# EAGLE design gpi-pwr (EAGLE 7.5.0)
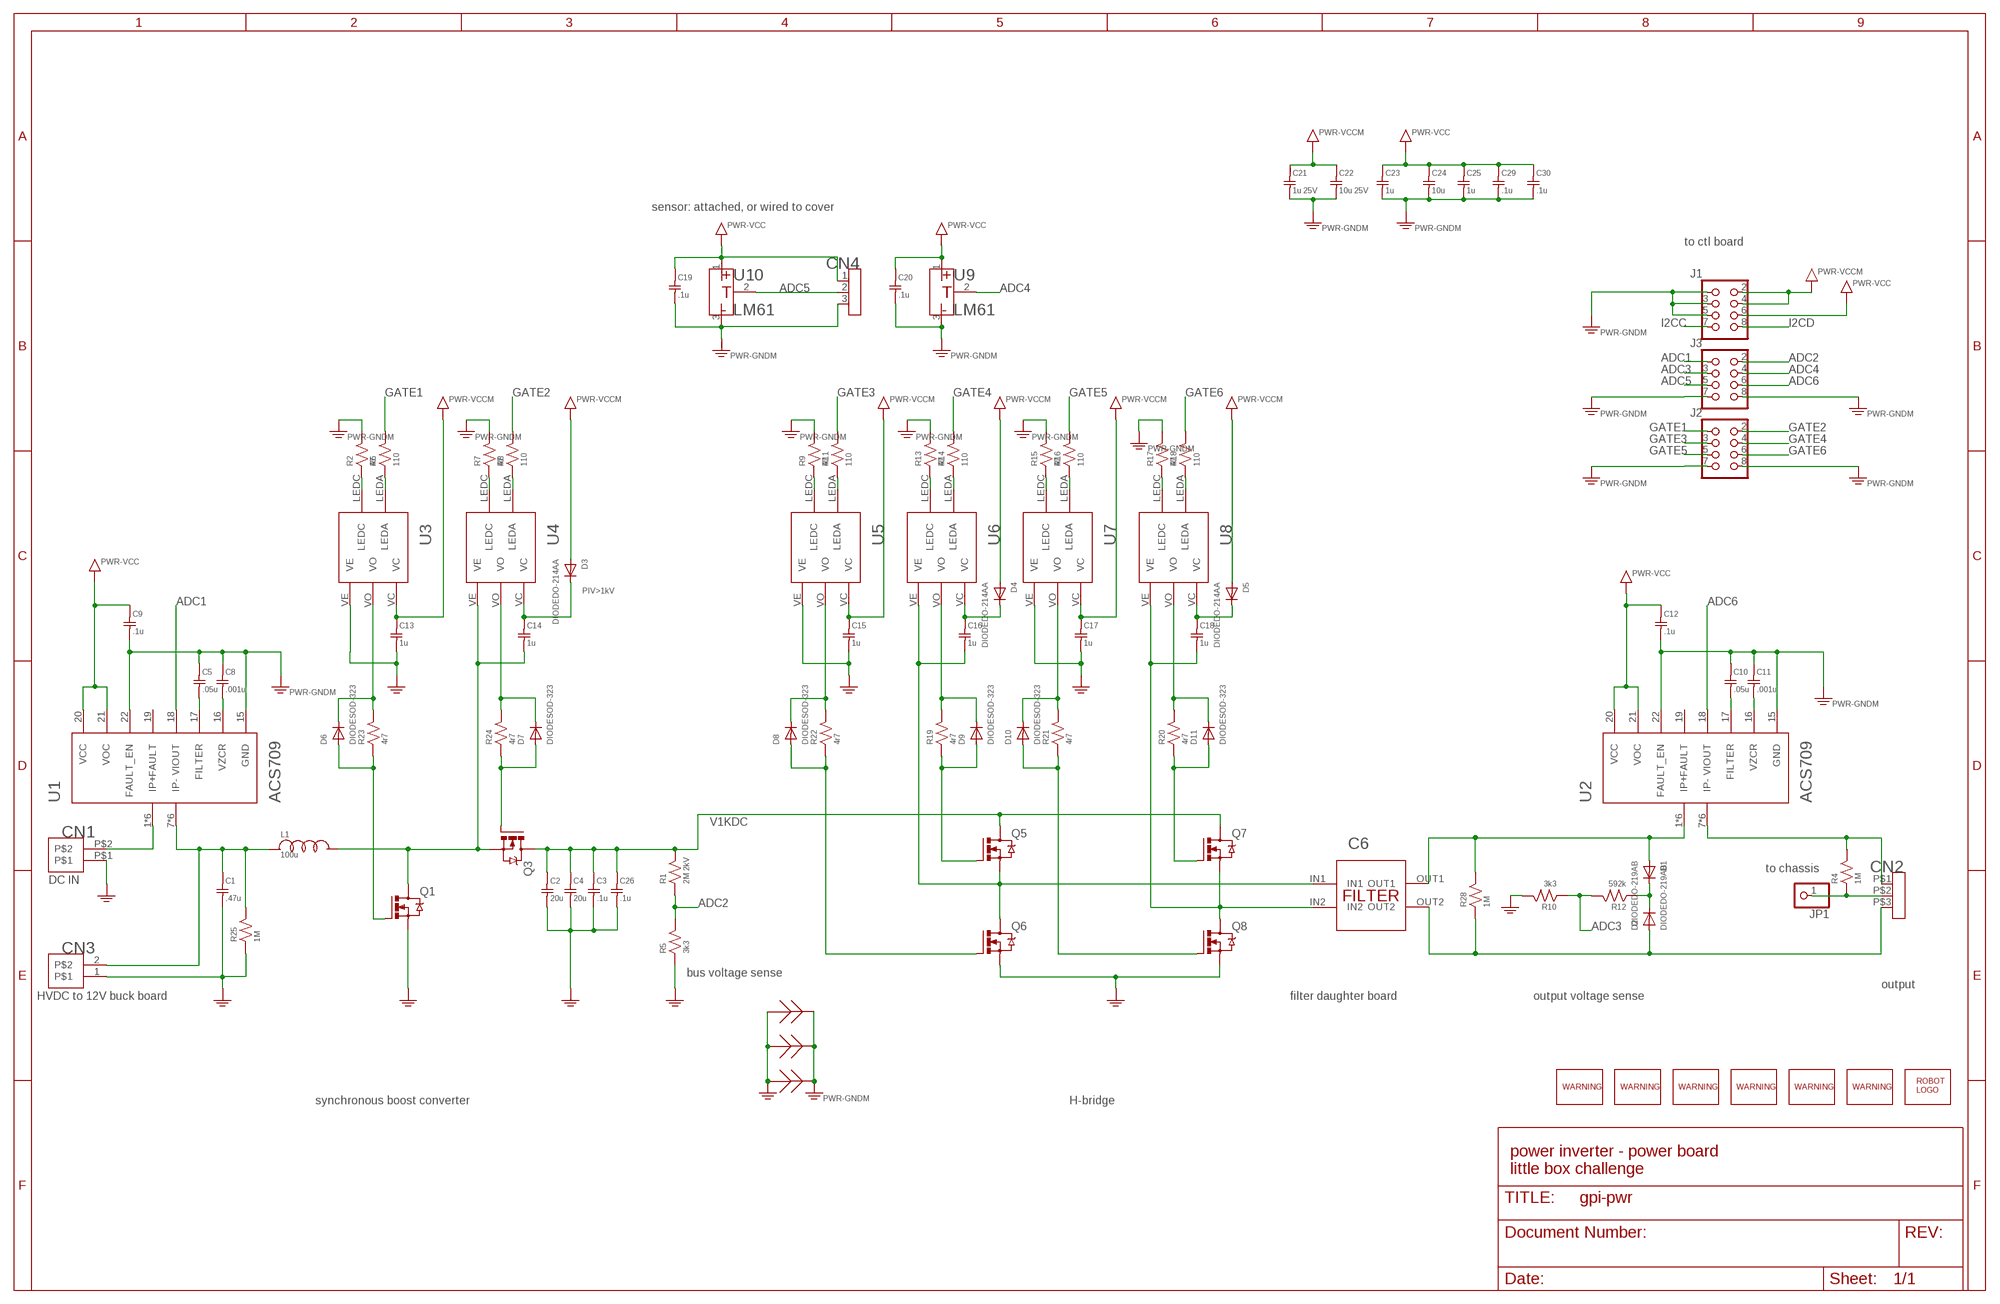
[diagram p0: schematic, sheet 1]

## Parts
C1  .47u  CR46KI333000N1M  [R46KI333000N1M]
C2  20u  CMKP1848S62010JY5F  [MKP1848S62010JY5F]
C3  .1u  C2220  [SMD2220]
C4  20u  CMKP1848S62010JY5F  [MKP1848S62010JY5F]
C5  .05u  C0603  [SMD0603]
C6  FILTER  [FILTER-B4R0]
C8  .001u  C0603  [SMD0603]
C9  .1u  C0603  [SMD0603]
C10  .05u  C0603  [SMD0603]
C11  .001u  C0603  [SMD0603]
C12  .1u  C0603  [SMD0603]
C13  1u  C0603  [SMD0603]
C14  1u  C0603  [SMD0603]
C15  1u  C0603  [SMD0603]
C16  1u  C0603  [SMD0603]
C17  1u  C0603  [SMD0603]
C18  1u  C0603  [SMD0603]
C19  .1u  C0603  [SMD0603]
C20  .1u  C0603  [SMD0603]
C21  1u 25V  C0603  [SMD0603]
C22  10u 25V  C0603  [SMD0603]
C23  1u  C0603  [SMD0603]
C24  10u  C0603  [SMD0603]
C25  1u  C0603  [SMD0603]
C26  .1u  C2220  [SMD2220]
C29  .1u  C0603  [SMD0603]
C30  .1u  C0603  [SMD0603]
CN1  HEADER-1X2  [CONN-10AWG-2]
CN2  HEADER-3X1  [CONN-10AWG-3]
CN3  HEADER-1X2.4  [HEADER-1X2-THM-WIDE]
CN4  HEADER-3X12MM  [HEADER-3X1-2SMD]
D1  DIODEDO-219AB  [DO-219AB]
D2  DIODEDO-219AB  [DO-219AB]
D3  DIODEDO-214AA  [DO-214AA]
D4  DIODEDO-214AA  [DO-214AA]
D5  DIODEDO-214AA  [DO-214AA]
D6  DIODESOD-323  [SOD-323]
D7  DIODESOD-323  [SOD-323]
D8  DIODESOD-323  [SOD-323]
D9  DIODESOD-323  [SOD-323]
D10  DIODESOD-323  [SOD-323]
D11  DIODESOD-323  [SOD-323]
J1  HEADER-2X4  [HEADER-2X04]
J2  HEADER-2X4  [HEADER-2X04]
J3  HEADER-2X4  [HEADER-2X04]
JP1  PINHD-1X1  [1X01]
L1  100u  LAIRD03  [AIRD03]
Q1  C2M0160120D  MOSFETTO247REV  [TO-247-3-DOWN]
Q3  C2M0160120D  MOSFETTO247REV  [TO-247-3-DOWN]
Q5  C2M0160120D  MOSFETTO247REV  [TO-247-3-DOWN]
Q6  C2M0160120D  MOSFETTO247REV  [TO-247-3-DOWN]
Q7  C2M0160120D  MOSFETTO247REV  [TO-247-3-DOWN]
Q8  C2M0160120D  MOSFETTO247REV  [TO-247-3-DOWN]
R1  2M 2kV  R2512  [SMD2512]
R2  47  R0603  [SMD0603]
R4  1M  R1206  [SMD1206]
R5  3k3  R0603  [SMD0603]
R6  110  R0603  [SMD0603]
R7  47  R0603  [SMD0603]
R8  110  R0603  [SMD0603]
R9  47  R0603  [SMD0603]
R10  3k3  R0603  [SMD0603]
R11  110  R0603  [SMD0603]
R12  592k  R1206  [SMD1206]
R13  47  R0603  [SMD0603]
R14  110  R0603  [SMD0603]
R15  47  R0603  [SMD0603]
R16  110  R0603  [SMD0603]
R17  47  R0603  [SMD0603]
R18  110  R0603  [SMD0603]
R19  4r7  RSMD0508  [SMD0508]
R20  4r7  RSMD0508  [SMD0508]
R21  4r7  RSMD0508  [SMD0508]
R22  4r7  RSMD0508  [SMD0508]
R23  4r7  RSMD0508  [SMD0508]
R24  4r7  RSMD0508  [SMD0508]
R25  1M  R1206  [SMD1206]
R28  1M  R1206  [SMD1206]
U1  ACS709  [QSOP24]
U2  ACS709  [QSOP24]
U3  ACPL-P346P346  [ACPL-P346]
U4  ACPL-P346P346  [ACPL-P346]
U5  ACPL-P346P346  [ACPL-P346]
U6  ACPL-P346P346  [ACPL-P346]
U7  ACPL-P346P346  [ACPL-P346]
U8  ACPL-P346P346  [ACPL-P346]
U9  LM61  TEMPERATURE  [SOT-23]
U10  LM61  TEMPERATURE  [SOT-23]
U$1  ROBOTMAN-LOGO  [ROBOTMAN-LOGO]
U$2  SYMBOL-WARNING  [SYMBOL-WARNING]
U$3  SYMBOL-WARNING  [SYMBOL-WARNING]
U$4  SYMBOL-WARNING  [SYMBOL-WARNING]
U$5  SYMBOL-WARNING  [SYMBOL-WARNING]
U$6  SYMBOL-WARNING  [SYMBOL-WARNING]
U$7  SYMBOL-WARNING  [SYMBOL-WARNING]
Z1  SHORT  [SHORT]
Z2  SHORT  [SHORT]
Z3  SHORT  [SHORT]

## Nets
ADC1: J3.1 U1.18(VIOUT)
ADC2: J3.2 R1.P$1 R5.2
ADC3: J3.3 R10.1 R12.2
ADC4: J3.4 U9.2(OUT)
ADC5: CN4.2 J3.5 U10.2(OUT)
ADC6: J3.6 U2.18(VIOUT)
GATE1: J2.1 R6.2
GATE2: J2.2 R8.2
GATE3: J2.3 R11.2
GATE4: J2.4 R14.2
GATE5: J2.5 R16.2
GATE6: J2.6 R18.2
GND: C1.P$2 C2.2A C2.2B C3.P$2 C4.2A C4.2B C13.2 C15.2 C17.2 C26.P$2 CN1.P$1 CN3.1 Q1.3(S) Q6.3(S) Q8.3(S) R5.1 R10.2 R25.1 U3.VE U5.VE U7.VE Z1.P$1 Z2.P$1 Z3.P$1 ; supply symbol labelled PWR-GND
GNDM: C5.1 C8.1 C9.2 C10.1 C11.1 C12.2 C19.2 C20.2 C21.2 C22.2 C23.2 C24.2 C25.2 C29.2 C30.2 CN4.3 J1.1 J1.3 J1.5 J2.7 J2.8 J3.7 J3.8 R2.2 R7.2 R9.2 R13.2 R15.2 R17.2 U1.15(GND) U1.22(FAULT_EN) U2.15(GND) U2.22(FAULT_EN) U9.3(G) U10.3(G) Z1.P$2 Z2.P$2 Z3.P$2 ; supply symbol labelled PWR-GNDM
I2CC: J1.7
I2CD: J1.8
N$1: CN1.P$2 U1.1(IP+) U1.2(IP+) U1.3(IP+) U1.4(IP+) U1.5(IP+) U1.6(IP+)
N$2: D9.C R19.P$2 U6.VO
N$4: C14.2 L1.P$2 Q1.2(D) Q3.3(S) U4.VE
N$5: D6.A Q1.1(G) R23.P$1
N$6: D6.C R23.P$2 U3.VO
N$7: C1.P$1 CN3.2 L1.P$1 R25.2 U1.7(IP-) U1.8(IP-) U1.9(IP-) U1.10(IP-) U1.11(IP-) U1.12(IP-)
N$9: D1.C D2.C R12.1
N$10: CN2.P$1 R4.2 U2.7(IP-) U2.8(IP-) U2.9(IP-) U2.10(IP-) U2.11(IP-) U2.12(IP-)
N$11: CN2.P$2 JP1.1 R4.1
N$12: C5.2 U1.17(FILTER)
N$13: C8.2 U1.16(VZCR)
N$14: C10.2 U2.17(FILTER)
N$15: C6.IN1 C16.2 Q5.3(S) Q6.2(D) U6.VE
N$16: C6.IN2 C18.2 Q7.3(S) Q8.2(D) U8.VE
N$17: C11.2 U2.16(VZCR)
N$18: C14.1 D3.C U4.VC
N$19: D9.A Q5.1(G) R19.P$1
N$20: D8.A Q6.1(G) R22.P$1
N$21: D10.A Q8.1(G) R21.P$1
N$22: D11.A Q7.1(G) R20.P$1
N$23: R2.1 U3.LEDC
N$24: C6.OUT1 D1.A R28.2 U2.1(IP+) U2.2(IP+) U2.3(IP+) U2.4(IP+) U2.5(IP+) U2.6(IP+)
N$25: C6.OUT2 CN2.P$3 D2.A R28.1
N$28: C16.1 D4.C U6.VC
N$29: R6.1 U3.LEDA
N$30: C18.1 D5.C U8.VC
N$31: R7.1 U4.LEDC
N$34: R8.1 U4.LEDA
N$35: R9.1 U5.LEDC
N$36: R11.1 U5.LEDA
N$37: R13.1 U6.LEDC
N$38: R14.1 U6.LEDA
N$39: R15.1 U7.LEDC
N$40: R16.1 U7.LEDA
N$41: R17.1 U8.LEDC
N$42: R18.1 U8.LEDA
N$43: D11.C R20.P$2 U8.VO
N$44: D8.C R22.P$2 U5.VO
N$46: D10.C R21.P$2 U7.VO
N$47: D7.C R24.P$2 U4.VO
N$48: D7.A Q3.1(G) R24.P$1
V1KDC: C2.1A C2.1B C3.P$1 C4.1A C4.1B C26.P$1 Q3.2(D) Q5.2(D) Q7.2(D) R1.P$2
VCC: C9.1 C12.1 C19.1 C20.1 C23.1 C24.1 C25.1 C29.1 C30.1 CN4.1 J1.6 U1.20(VCC) U1.21(VOC) U2.20(VCC) U2.21(VOC) U9.1(V) U10.1(V) ; supply symbol labelled PWR-VCC
VCCM: C13.1 C15.1 C17.1 C21.1 C22.1 D3.A D4.A D5.A J1.2 J1.4 U3.VC U5.VC U7.VC ; supply symbol labelled PWR-VCCM
Unconnected: U1.19(FAULT) U2.19(FAULT)

## Notes on the sheet
- sensor: attached, or wired to cover
- to ctl board
- PIV>1kV
- to chassis
- DC IN
- bus voltage sense
- output
- HVDC to 12V buck board | filter daughter board | output voltage sense
- synchronous boost converter | H-bridge
- power inverter - power board
  little box challenge

## Library data of the parts
C1-C5 C8-C26 C29 C30 = jaw:C
C6 = jaw-brd:FILTER
CN1 CN3 = jaw:HEADER-1X2
CN2 CN4 = jaw:HEADER-3X1
D1-D11 = jaw:DIODE
J1-J3 = jaw:HEADER-2X4: PIN HEADER
JP1 = adafruit:PINHD-1X1: Pin header 1x1 for 0.1" spacing With round pins
L1 = jaw:L
Q1 Q3 Q5-Q8 = jaw:MOSFET
R1 R2 R4-R25 R28 = jaw:R
U1 U2 = jaw:ACS709
U3-U8 = jaw:ACPL-P346
U9 U10 = jaw:TEMPERATURE
U$1 = jaw:ROBOTMAN-LOGO
U$2-U$7 = jaw:SYMBOL-WARNING
Z1-Z3 = jaw:SHORT

## Board
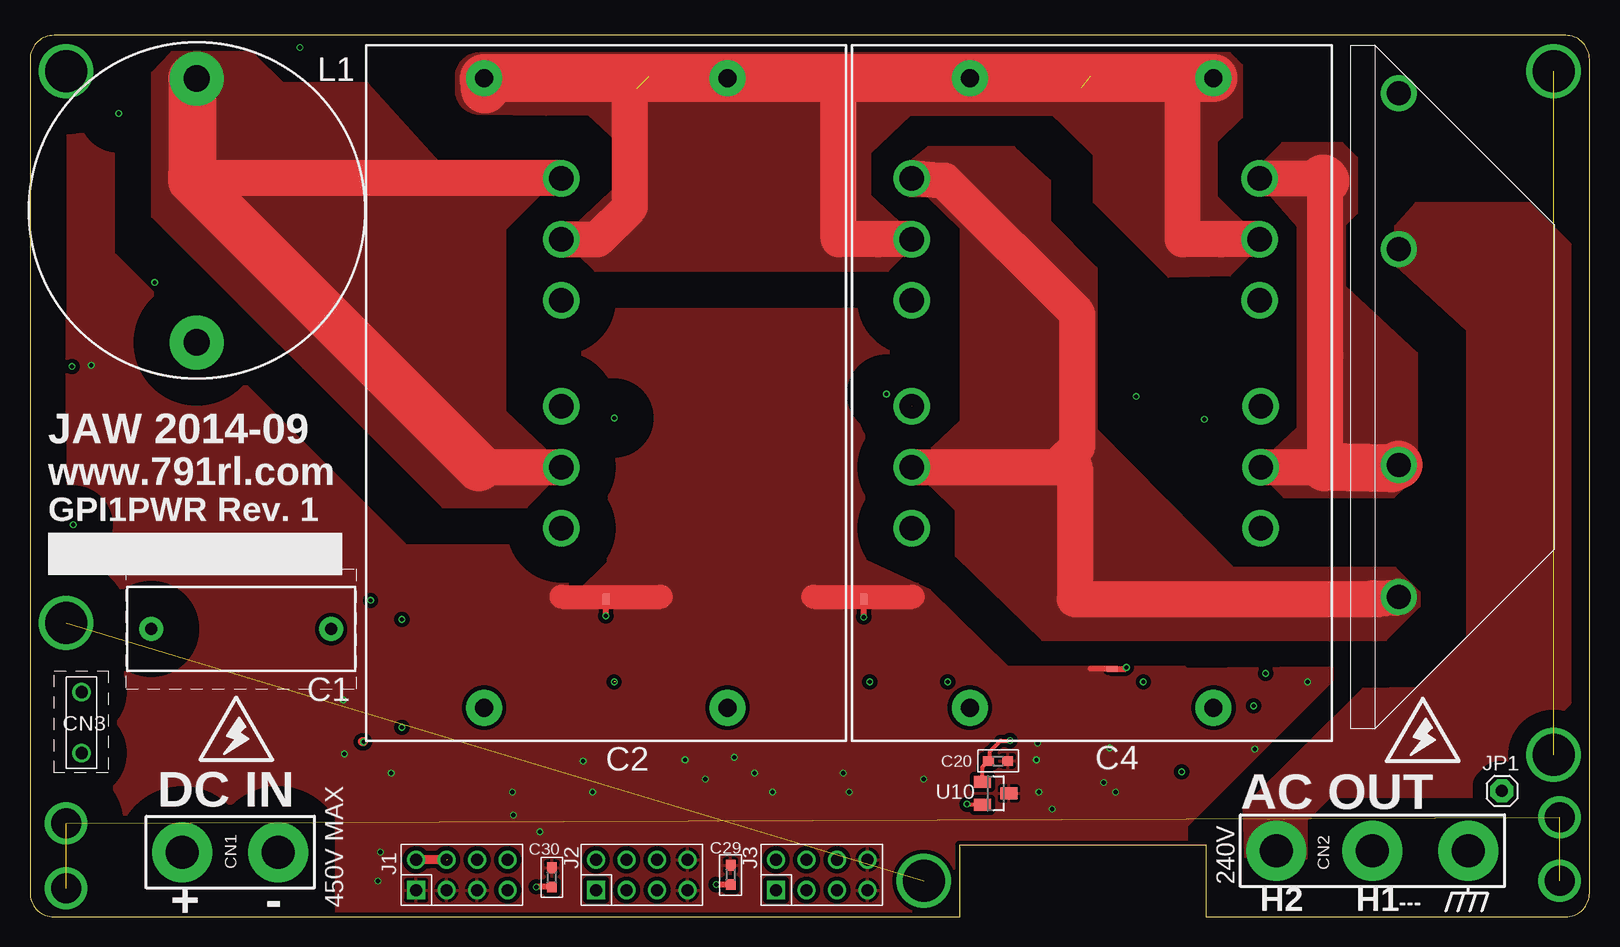
[diagram p1: board, top side]
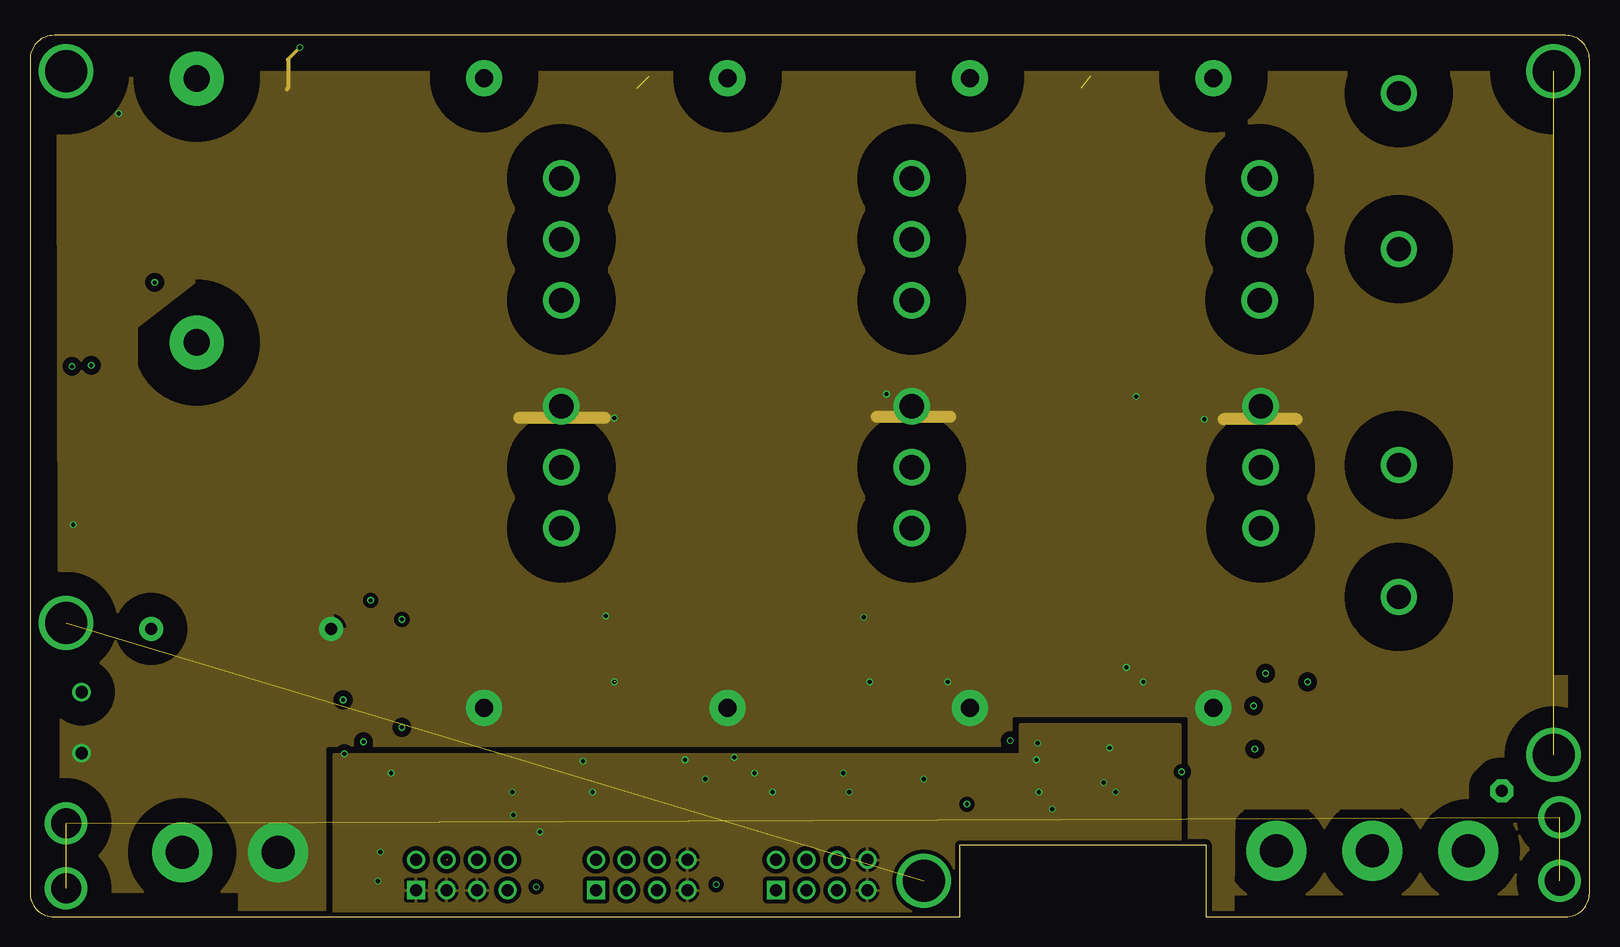
[diagram p2: board, inner layer Ground]
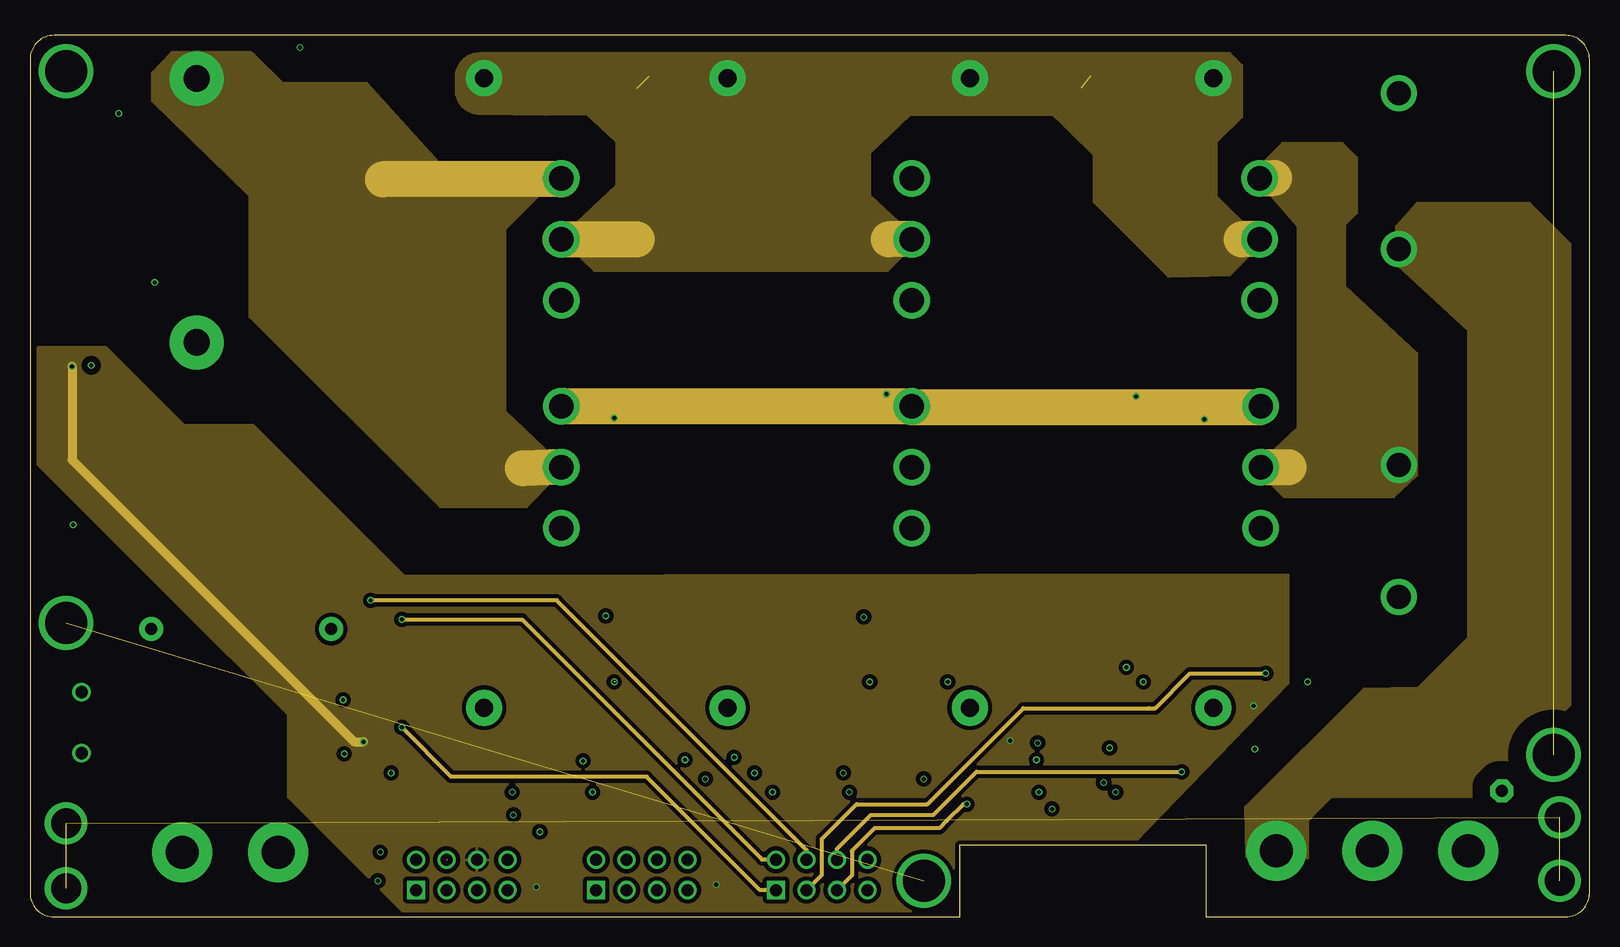
[diagram p3: board, inner layer Signal]
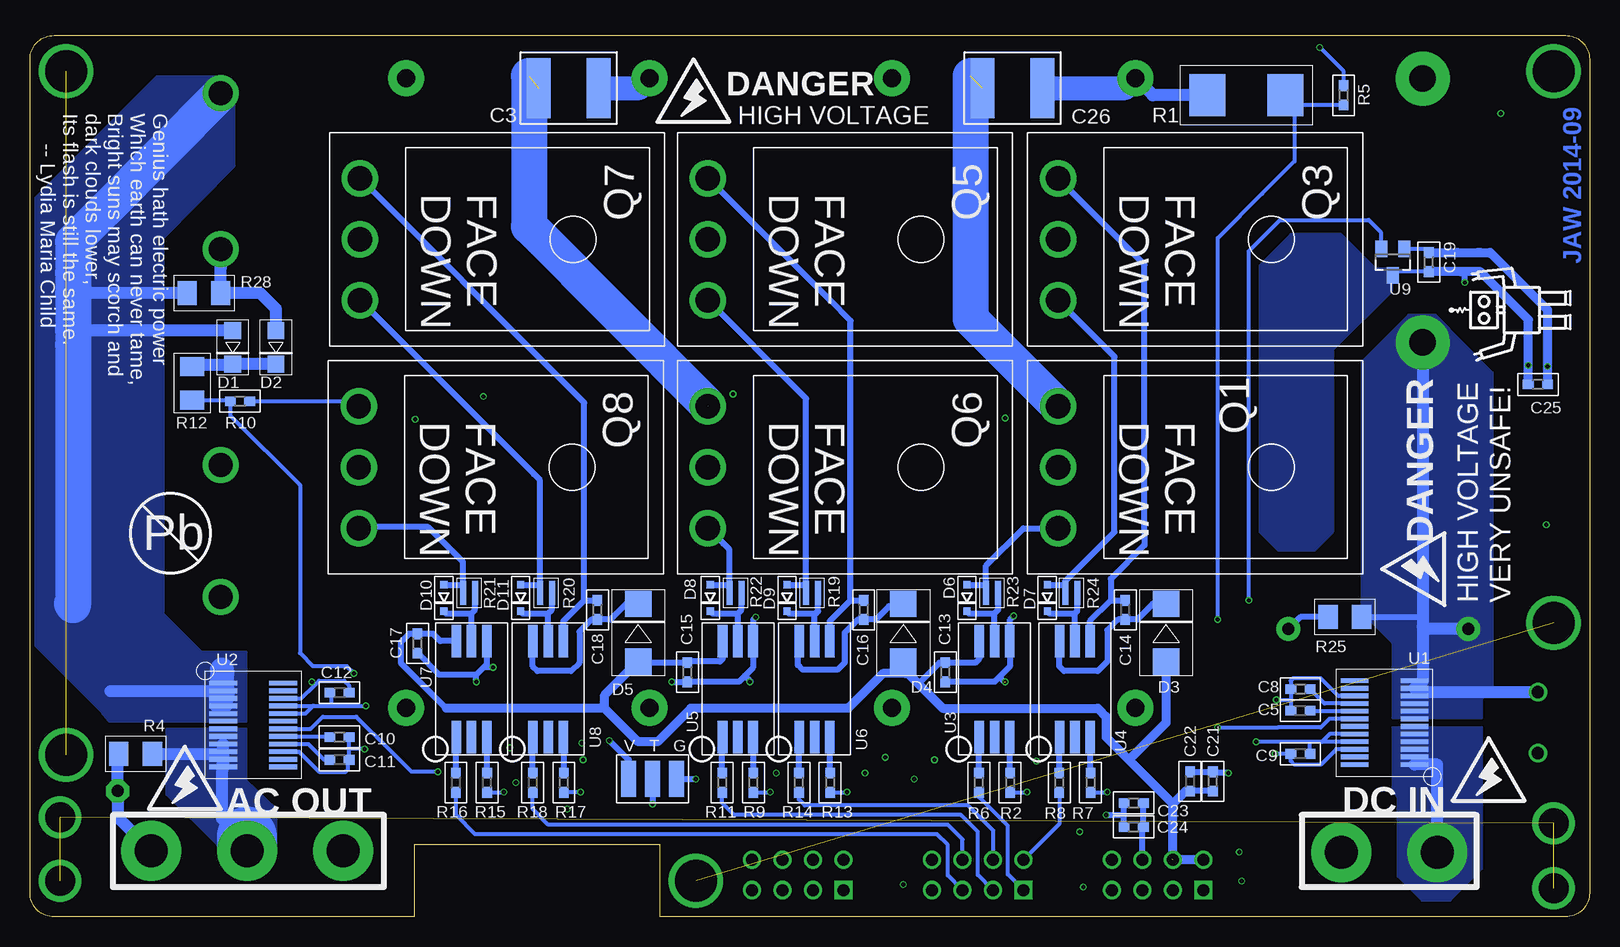
[diagram p4: board, bottom side, seen from below]

Size 130 x 73.5 mm. Coordinates in mm from the lower left corner, seen from the top.
Outline: 0,71.5 0,2 arc90 2,0 77.5,0 77.5,6 98,6 98,0 128,0 arc90 130,2 130,71.5 arc90 128,73.5 2,73.5 arc90 0,71.5
Copper layers (1*2*15*16): Top 0.035559375mm / dielectric 0.17018125mm / Ground 0.01778125mm / dielectric 47mil / Signal 0.01778125mm / dielectric 0.17018125mm / Bottom 0.035559375mm
Design rules "OSHPark-4layer (1)": minimum track width 5mil, minimum drill 10mil, track to track 5mil, track to pad 5mil, pad to pad 5mil, via to via 5mil, smd to smd 5mil, copper to edge 15mil, drill to drill 6mil, minimum pad ring 4mil, minimum via ring 4mil, stop-mask expansion 4mil, vias tented up to drill 0mil, thermal gap 10mil

### Footprints (pad centres in the part's own frame; a part is rotated, then mirrored left to right if it is on the bottom)
R46KI333000N1M = drill 1 pad 2: P$1 -7.5,0; P$2 7.5,0
MKP1848S62010JY5F = drill 1.5 pad 3: 1A -26.25,10.15; 1B -26.25,-10.15; 2A 26.25,10.15; 2B 26.25,-10.15
SMD2220 = smd 2 x 5: P$1 -2.5,0; P$2 2.5,0
SMD0603 = smd 0.9 x 0.8: 1 -0.8,0; 2 0.8,0
FILTER-B4R0 = drill 2: IN1 -20,0; IN2 -9,0; OUT1 22,0; OUT2 9,0
CONN-10AWG-2 = drill 2.75 pad 5: P$1 4,0; P$2 -4,0
CONN-10AWG-3 = drill 2.75 pad 5: P$1 0,0; P$2 8,0; P$3 -8,0
HEADER-1X2-THM-WIDE = drill 1.016: 1 -2.54,0; 2 2.54,0
HEADER-3X1-2SMD = smd 1.25 x 3: 1 -2,0; 2 0,0; 3 2,0
DO-219AB = smd 1.4 x 1.4: A -1.4,0; C 1.4,0
DO-214AA = smd 2.2 x 2.2: A -2.4,0; C 2.4,0
SOD-323 = smd 0.6 x 0.6: A 1.1,0; C -1.1,0
HEADER-2X04 = drill 1.016 square: 1 -3.81,-1.27 | drill 1.016: 2 -3.81,1.27; 3 -1.27,-1.27; 4 -1.27,1.27; 5 1.27,-1.27; 6 1.27,1.27; 7 3.81,-1.27; 8 3.81,1.27
1X01 = drill 1.016 pad 1.93 octagon: 1 0,0
AIRD03 = drill 2.2 pad 4.5: P$1 -11,0; P$2 11,0
TO-247-3-DOWN = drill 2.032 pad 3.048: 1 0,-5.08; 2 0,0; 3 0,5.08
SMD2512 = smd 3 x 3.5: P$1 -3.25,0; P$2 3.25,0
SMD1206 = smd 1.6 x 2: 1 -1.4,0; 2 1.4,0
SMD0508 = smd 0.5 x 2: P$1 -0.5,0; P$2 0.5,0
QSOP24 = smd 0.4 x 2.3: 1 -3.493,-2.5; 2 -2.857,-2.5; 3 -2.223,-2.5; 4 -1.587,-2.5; 5 -0.953,-2.5; 6 -0.318,-2.5; 7 0.318,-2.5; 8 0.953,-2.5; 9 1.587,-2.5; 10 2.223,-2.5; 11 2.857,-2.5; 12 3.493,-2.5; 13 3.493,2.5; 14 2.857,2.5; 15 2.223,2.5; 16 1.587,2.5; 17 0.953,2.5; 18 0.318,2.5; 19 -0.318,2.5; 20 -0.953,2.5; 21 -1.587,2.5; 22 -2.223,2.5; 23 -2.857,2.5; 24 -3.493,2.5
ACPL-P346 = smd 0.8 x 2.7: LEDA -1.27,-4; LEDC 1.27,-4; P$2 0,-4; VC -1.27,4; VE 1.27,4; VO 0,4
SOT-23 = smd 1 x 1.4: 1 -0.95,-1.1; 2 0.95,-1.1; 3 0,1.1
SHORT = smd 0.5 x 0.5: P$1 -0.2,0; P$2 0.2,0

### Placement (x,y rotation side)
C1  17.6,24 0 top
C2  48,43.7 270 top
C3  85.1,69.1 180 bottom
C4  88.5,43.7 270 top
C5  24.1,17.2 0 bottom
C6  114.1,46.7 90 top
C8  24.1,19 0 bottom
C9  24.1,13.6 180 bottom
C10  104.2,15 180 bottom
C11  104.2,13.1 180 bottom
C12  104.2,18.7 0 bottom
C13  53.7,20.4 270 bottom
C14  38.7,25.6 90 bottom
C15  75.2,20.4 270 bottom
C16  60.5,25.6 90 bottom
C17  97.7,22.8 270 bottom
C18  82.7,25.6 90 bottom
C19  13.4,54.6 270 bottom
C20  80.7,13 0 top
C21  31.4,11.3 90 bottom
C22  33.3,11.3 90 bottom
C23  38,9.5 180 bottom
C24  38,7.5 180 bottom
C25  4.3,44.4 180 bottom
C26  48.1,69.1 180 bottom
C29  58.4,3.5 90 top
C30  43.5,3.3 90 top
CN1  16.7,5.4 0 top
CN2  111.9,5.52 0 top
CN3  4.3,16.2 90 top
CN4  78.1,11.5 0 bottom
D1  113.1,47.5 270 bottom
D2  109.5,47.5 270 bottom
D3  35.3,23.7 90 bottom
D4  57.2,23.7 90 bottom
D5  79.3,23.7 90 bottom
D6  51.9,26.6 90 bottom
D7  45.2,26.6 90 bottom
D8  73.3,26.6 90 bottom
D9  66.9,26.6 90 bottom
D10  95.5,26.6 90 bottom
D11  89.1,26.6 90 bottom
J1  36,3.5 0 top
J2  51,3.5 0 top
J3  66,3.5 0 top
JP1  122.7,10.5 0 top
L1  13.9,58.9 90 top
Q1  44.3,37.5 0 bottom
Q3  44.3,56.5 0 bottom
Q5  73.5,56.5 0 bottom
Q6  73.5,37.5 0 bottom
Q7  102.5,56.5 0 bottom
Q8  102.6,37.5 0 bottom
R1  28.6,68.5 180 bottom
R2  48.3,11.2 270 bottom
R4  121.2,13.6 0 bottom
R5  20.5,68.5 270 bottom
R6  50.9,11.2 270 bottom
R7  41.6,11.2 270 bottom
R8  44.2,11.2 270 bottom
R9  69.7,11.2 270 bottom
R10  112.5,43 0 bottom
R11  72.3,11.2 270 bottom
R12  116.5,44.5 270 bottom
R13  63.3,11.2 270 bottom
R14  65.9,11.2 270 bottom
R15  91.9,11.2 270 bottom
R16  94.5,11.2 270 bottom
R17  85.5,11.2 270 bottom
R18  88.1,11.2 270 bottom
R19  64.8,27 0 bottom
R20  87,27 0 bottom
R21  93.4,27 0 bottom
R22  71.2,27 0 bottom
R23  49.8,27 0 bottom
R24  43.2,27 0 bottom
R25  20.4,25 0 bottom
R28  115.5,52 180 bottom
U1  17.1,16.2 90 bottom
U2  111.4,16 270 bottom
U3  49.6,19 0 bottom
U4  42.9,19 0 bottom
U5  71,19 0 bottom
U6  64.6,19 0 bottom
U7  93.2,19 0 bottom
U8  86.8,19 0 bottom
U9  16.4,54.6 180 bottom
U10  80.5,10.3 270 top
U$1  5.9,50.6 90 bottom
U$2  116.1,15 0 top
U$3  17.2,15.1 0 top
U$4  74.7,68.3 0 bottom
U$5  14.1,29 90 bottom
U$6  8.4,11.7 0 bottom
U$7  117.1,11 0 bottom
Z1  69.5,26.5 90 top
Z2  48,26.5 90 top
Z3  90.2,20.7 180 top

### Tracks (layer width: path | path; a pad name or v marks a point on that pad's centre or on a via)
ADC1  (via drill 0.35)
  Signal 0.35: J3.1 60.87,2.23 51.4,11.7 35.1,11.7 v31,15.8
  Bottom 0.35: U1.18 21.68,16.52 22.4,15.8 26,15.8 30,15.8 v31,15.8
ADC2  (via drill 0.35)
  Signal 0.35: v31,24.8 41,24.8 61,4.8 62.16,4.8 J3.2
  Bottom 0.35: v31,24.8 31,56.6 27.3,60.3 24.6,63 24.6,67.75 | R1.P$1 24.6,67.75 | R5.2 24.55,67.7 24.6,67.75
ADC3  (via drill 0.35)
  Signal 0.35: J3.3 64.8,2.3 66,3.5 66,6.5 68.9,9.4 74.8,9.4 82.8,17.4 93.3,17.4 93.8,17.4 96.7,20.3 v103,20.3
  Bottom 0.35: v103,20.3 103.6,20.9 106.4,20.9 107.5,22 107.5,36 113.3,41.8 R10.1 113.4,43.1 R12.2
ADC4  (via drill 0.35)
  Signal 0.35: v28.4,26.4 43.1,26.4 43.9,26.4 63.7,6.6 64.73,5.57 J3.4
  Bottom 0.35: v28.4,26.4 28.4,55.5 25.8,58.1 18.4,58.1 17.4,57.1 17.4,55.75 U9.2
ADC5  (via drill 0.35)
  Top 0.35: U10.2 78.35,9.35 v78.1,9.4
  Signal 0.35: J3.5 68.5,3.46 68.5,5.5 70.4,7.4 75.8,7.4 76.4,8 77.8,9.4 v78.1,9.4
  Bottom 0.5: CN4.2 v78.1,9.4
ADC6  (via drill 0.35)
  Signal 0.35: J3.6 67.27,5.67 70.1,8.5 75.3,8.5 78.9,12.1 v96,12.1
  Bottom 0.35: U2.18 106.62,15.68 105.6,16.7 102.8,16.7 100,13.9 98.2,12.1 v96,12.1
GATE1
  Bottom 0.35: J2.1 48.5,3.54 48.5,7.6 50.9,10 R6.2
GATE2
  Bottom 0.35: R8.2 44.2,7.76 J2.2
GATE3
  Bottom 0.35: J2.3 51,3.5 51,7.1 52.4,8.5 71.3,8.5 72.3,9.5 R11.2
GATE4
  Bottom 0.35: J2.4 49.7,4.8 49.7,7.2 51.8,9.3 65.4,9.3 65.9,9.8 R14.2
GATE5
  Bottom 0.35: J2.5 53.5,3.46 53.5,6 54.4,6.9 92.9,6.9 94.5,8.5 R16.2
GATE6
  Bottom 0.35: J2.6 52.27,6.47 53.5,7.7 86.8,7.7 88.1,9 R18.2
GND  (via drill 0.35)  (4 unrouted)
  Top 0.5: Z3.P$1 91.3,20.7 v91.4,20.8 | v69.5,25 Z1.P$1 | v48,25.1 Z2.P$1
  Ground 0.3: 21.5,71.5 v22.5,72.5
  Ground 0.35: 21.5,71.5 21.5,69.1 21.4,69
  Ground 1: 47.9,41.6 40.8,41.6 | 76.7,41.7 70.6,41.7 | 105.6,41.5 99.5,41.5
  Signal 3: 44.4,42.6 73.5,42.6 73.5,42.5 102.5,42.5
  Bottom 0.35: R10.2 103.02,43 Q8.3 | R5.1 20.5,70.5 v22.5,72.5
  Bottom 0.5: R25.1 24.1,25 C1.P$2 | U3.VE 48.33,20.87 49.2,20 | 49.2,20 49.6,19.6 C13.2 | U5.VE 69.73,20.77 70.4,20.1 | 70.4,20.1 70.9,19.6 75.1,19.6 | 75.1,19.6 C15.2 | U7.VE 91.93,21.07 92.25,20.75 | 92.25,20.75 92.8,20.2 | 92.8,20.2 95.9,20.2 C17.2 | v91.4,20.8 92.25,20.75 | v76.5,19.6 75.1,19.6 | 69.9,19.6 70.4,20.1 | 69.7,23.1 69.7,24.8 v69.5,25 | 48.8,19.6 49.2,20 | 48.3,23.2 48.3,24.8 v48,25.1 | v92.8,19.6 92.8,20.2
  Bottom 1: 51.9,63.2 51.6,63.5
  Bottom 3: 88.4,70.1 88.4,57.58 Q6.3 | 51.6,70.1 51.6,63.5 51.6,49.88 Q1.3
  other vias: 7.4,67 48.7,41.6 92.2,43.4 97.9,41.5 71.4,43.6 3.6,32.7 48.7,19.6 70,19.6
  pour Ground (isolate 3, rank 6, no thermals): -0.5,74 133.5,74 133.5,-0.5 -0.5,-0.5
  pour Ground (isolate 0.5, rank 6, no thermals): 17.5,24 110.4,23.9 114.1,9.1 100.3,9.1 100.2,-2.2 17.5,-2.1
  pour Ground (isolate 0.35): 23,30.1 33.6,30.1 33.6,27.5 85.9,27.5 85.9,19.7 23,19.7
  pour Ground (isolate 2): 2.5,31.5 19.5,31.5 19.7,-1.4 2.7,-1.4
  pour Ground (isolate 0.5): 2.4,28.9 8.9,28.9 8.9,49.2 13.7,52.9 13.7,59.5 9,64.2 8.9,65.1 2.3,65.1
  pour Ground (isolate 1.8, rank 2, no thermals): 100.1,-0.7 130.6,-0.7 130.6,20 112.5,20 112.5,8.9 100.1,8.9
GNDM  (via drill 0.35)
  Top 0.35: 34.7,2.2 J1.3
  Top 0.5: Z2.P$2 44.3,26.7 | Z1.P$2 65.3,26.7 | 73.6,26.7 73.7,26.8 | Z3.P$2 88.4,20.7
  Top 2: 44.3,26.7 52.6,26.7 | 65.3,26.7 73.6,26.7
  Bottom 0.35: R15.2 v90.5,10.4 | v84.1,10.4 R17.2 | R9.2 v68.3,10.4 | R13.2 v61.9,10.4 | R2.2 v46.9,10.4 | R7.2 v40.2,10.4 | C19.2 16.1,53.8 U9.3 | 10.4,53.5 10.7,53.8 | U1.15 20.92,18.42 22.4,19.9 24.7,19.9 24.9,19.7 C8.1 24.9,18.1 | 24.9,18.1 C5.1 | U1.22 21.12,13.98 22.4,12.7 24.6,12.7 24.9,13 C9.2 v26.2,13.6 | v26.1,18.1 24.9,18.1 | U2.22 107.38,18.22 106.25,19.35 | 106.25,19.35 105.9,19.7 103.8,19.7 103.4,19.3 C12.2 | U2.15 107.58,13.78 105.9,12.1 103.7,12.1 103.5,12.3 103.5,13 C11.1 103.4,14 | 103.4,14 C10.1 | v106.5,19.6 106.25,19.35 | v102.1,14 103.4,14
  Bottom 0.5: C22.2 C21.2 31.3,12 v30.1,12 | v10.4,52.9 10.4,53.5 | C24.2 38.8,8.5 | 38.8,8.5 C23.2 | v40.3,8.5 38.8,8.5 | CN4.3 75,11.5 v74.5,11.5
  Bottom 0.75: C25.2 5.1,49.8 9.1,53.8 10.7,53.8 C19.2
  other vias: 60.4,12 56.3,11.5 29.2,5.4 29,3 89.5,11.2 85.2,9 84,14.5 54.6,13.1 42.5,7.1 83.9,13.1 90,14.1 58.7,13.3 46.1,13 67.8,12 5.1,46
  pour Top (isolate 0.35): 96.5,-0.5 96.3,20.8 81.5,20.8 75,27.2 69.6,29.7 69.4,29.9 48.5,29.9 45.2,26.6 27.7,30.6 19.9,26.1 19.9,15 25.5,11.3 25.5,-0.5
  pour Ground (isolate 0.35, rank 4): 95.9,-0.5 95.9,16 82.5,16 82.5,13.5 25.3,13.5 25.3,-0.5
  pour Top (isolate 3, rank 6, no thermals): -0.5,74 133.5,74 133.5,-0.5 -0.5,-0.5
  pour Top (isolate 0.35): 95.5,20.7 108.5,20.8 108.5,19.7 95.5,6.7
  pour Top (isolate 0.35): 3.1,50 7.4,50 7.4,41 3.1,41
  pour Bottom (no thermals): 16.5,54 17.8,54 20.7,56.9 24.9,56.9 27.5,54.3 27.5,32.1 26,30.6 22.9,30.6 21.4,32.1 21.4,47.3 16.5,52.2
N$1
  Bottom 1: CN1.P$2 12.7,12.71 U1.1
  pour Bottom (no thermals): 9,15.8 16.4,15.8 16.4,10.5 16,10 16,3.4 14,1.4 11.6,1.4 9,4
N$2
  Bottom 0.5: D9.C 66.7,25.3 64.5,25.3 | 64.5,25.3 64.3,25.5 R19.P$2 | U6.VO 64.6,25.2 64.5,25.3
N$4
  Top 3: 37.4,37.5 Q1.2 | Q3.3 13.82,61.58 13.5,61.9
  Top 4: L1.P$2 13.54,69.86 13.5,69.9 13.5,61.9 13.5,61.4 32.05,42.85 37.4,37.5
  Signal 3: 44.3,61.5 29.4,61.5 | Q1.2 41.1,37.4
  Bottom 0.5: Q3.3 37.1,54.38 37.1,32.1 37.1,31.5 37.1,31 39.9,28.2 39.9,26.4 | U4.VE 41.63,24.67 39.9,26.4 | 39.9,26.4 C14.2
  pour Top (no thermals): 42.7,60.4 39.6,57.3 39.6,42.2 43.7,38.3 43.7,36.5 41.4,34.2 34.4,34.2 10.2,58.4 10.2,70.4 11.8,72.1 18.4,72.1 18.7,71.9 21.1,69.5 28.1,69.5 34.1,62.9
  pour Signal (rank 2, no thermals): 42.7,60.4 39.6,57.3 39.6,42.2 43.7,38.3 43.7,36.5 41.4,34.2 34.2,34.2 18.3,50 18.3,60.1 10.2,68 10.2,70.4 11.8,72.1 18.4,72.1 18.7,71.9 21.1,69.5 28.1,69.5 34.1,62.9
N$5
  Bottom 0.5: Q1.1 44.32,32.4 47.2,32.4 50.3,29.3 50.3,27.7 | R23.P$1 50.3,27.7 | D6.A 50.3,27.7
N$6
  Bottom 0.5: U3.VO 49.6,25.3 | D6.C 51.7,25.3 49.6,25.3 | R23.P$2 49.3,25.6 49.6,25.3
N$7
  Bottom 0.5: 10.3,24.1 10.2,24.1 C1.P$1 10,24 | R25.2 13.9,25
  Bottom 1: CN3.2 12.58,18.74 14.28,18.74 U1.11 14.04,19.62 13.9,19.62 13.9,24.2 | L1.P$1 13.9,25 13.9,24.2 | C1.P$1 13.7,24 13.9,24.2
  pour Bottom (no thermals): 9,16.6 16.4,16.6 16.4,22.8 19,25.4 19,46.3 15.1,50.2 12.8,50.2 8.1,45.4 8.1,19.3 9,18.2
N$8  (via drill 2.5)  (3 unrouted)
  other vias: 3,7.8 127.5,8.3 127.5,3 3,2.4
N$9
  Bottom 1: D2.C D1.C 112.9,46 116.4,46 R12.1
N$10
  Bottom 1: 111.9,6.7 114,8.2 114,11.83 U2.11 | 113.92,13.2 U2.9 | R4.2 113.9,13.6 U2.12
  Bottom 5: CN2.P$1 111.9,6.7
  pour Bottom (no thermals): 118.6,15.7 112,15.7 112,11.4 109.5,9 109.5,5.7 114.4,6 118.6,10.2
N$11
  Bottom 1: R4.1 122.7,13.4 JP1.1 122.68,8.3 CN2.P$2
N$12
  Bottom 0.35: U1.17 23.25,17.15 C5.2
N$13
  Bottom 0.35: U1.16 22.09,17.79 C8.2
N$14
  Bottom 0.35: U2.17 105.05,15.05 C10.2
N$15
  Top 0.75: Q6.2 73.5,37.7 73.6,37.8
  Top 3: Q6.2 87.1,37.5 87.1,26.5 112.4,26.5 | 85.9,37.8 87.3,39.2 87.3,50.3 76.2,61.4 75.78,61.4 Q5.3 | 112.4,26.5 111.93,26.57 112.4,26.5 | C6.IN1 113.9,26.6 112.4,26.5
  Bottom 0.5: Q5.3 63.33,51.41 61.6,49.68 61.6,26.4 | U6.VE 63.33,24.67 61.6,26.4 | 61.6,26.4 C16.2
  pour Top (no thermals): 75.2,39.1 77.6,41.4 77.6,57.4 74.8,60.1 73.3,60.1 72.8,62.5 74.9,64.2 82,64.2 85,61.4 85,58 88.9,54.1 88.9,40.7 100.3,29.1 113.8,29.1 115.8,27.1 115.8,25.9 113,23.1 84.4,23.1 77.2,30.1 77.2,33.9 75,36
N$16
  Top 3: Q7.3 107.8,61.58 | Q8.2 104.4,37.5 107.9,37.5 107.99,37.5 107.99,46.8 107.99,61.58
  Top 4: 108,61.38 107.8,61.58 | C6.IN2 113.5,37.4 107.9,37.5
  Signal 3: Q8.2 104.9,37.5 | 102.5,61.6 103.7,61.6
  Bottom 0.5: Q7.3 85.53,44.61 83.8,42.88 83.8,26.4 | U8.VE 85.53,24.67 83.8,26.4 | 83.8,26.4 C18.2
  pour Top (no thermals): 103,38.3 105.7,40.8 105.7,57.6 102.9,60.8 102.9,63 104.4,64.5 109.4,64.5 110.6,63.3 110.6,58.7 109.6,57.7 109.6,52.6 115.6,47 115.6,36.8 113.7,35 104.5,35 103,36.5
  pour Signal (no thermals): 103,38.3 105.7,40.8 105.7,57.6 102.9,60.8 102.9,63 104.4,64.5 109.4,64.5 110.6,63.3 110.6,58.7 109.6,57.7 109.6,52.6 115.6,47 115.6,36.8 113.7,35 104.5,35 103,36.5
N$17
  Bottom 0.35: U2.16 106.81,14.41 105.5,13.1 C11.2
N$18
  Bottom 0.5: D3.C 36.4,26.1 37.7,24.8 C14.1 39.3,24.8 40.2,23.9 40.2,21.3 41,20.5 43.8,20.5 44.2,20.9 44.2,22.97 U4.VC
N$19
  Bottom 0.5: Q5.1 65.8,43.72 65.3,43.22 65.3,27.9 | R19.P$1 65.3,27.9 | D9.A 65.5,27.7 65.3,27.9
N$20
  Bottom 0.5: Q6.1 72.2,31.12 71.7,30.62 71.7,27.7 | R22.P$1 71.7,27.7 | D8.A 71.7,27.7
N$21
  Bottom 0.5: 102.52,32.5 Q8.1 102.52,32.5 | 102.52,32.5 96.8,32.5 94.4,30.1 93.9,29.6 93.9,27.7 | R21.P$1 93.9,27.7 | D10.A 93.9,27.7
N$22
  Bottom 0.5: Q7.1 88,36.92 87.5,36.42 87.5,27.7 | R20.P$1 87.5,27.7 | D11.A 87.5,27.7
N$23
  Bottom 0.5: R2.1 48.3,14.97 U3.LEDC
N$24
  Bottom 1: 123.28,18.84 U2.2 | D1.A 117.1,48.9 126.4,48.9 126.4,49.2 | 125.05,57.35 125.05,57.65 | R28.2 126.4,52 126.4,51.9
  Bottom 2: 114,20.6 114.1,17.83 U2.2
  Bottom 3: 126.5,26.1 126.4,26.01 126.4,47.7 126.4,48.9 126.4,49.2 126.4,51.9 126.4,52 126.4,53.7 126.4,56.3 125.05,57.65 123.9,58.8 C6.OUT1
  pour Bottom (no thermals): 112,16.3 123.4,16.3 124,17 131.5,24.5 131.5,25.4 129.6,27.3 121,27.4 115.7,22.1 112,22.1
  pour Bottom (no thermals): 118.9,23 118.9,56.6 113,62.6 113,69.5 113.8,70 119.5,70 131.5,58 131.5,23.1
N$25
  Bottom 1: C6.OUT2 114.1,54.1 R28.1 110.8,52 109.5,50.7 D2.A
  pour Signal (isolate 1.5, no thermals): 119.9,48.9 114,54.3 113.9,57.6 115.6,59.5 125,59.5 131,53.5 131,20.3 120.8,10 108.5,10 106.5,8 106.5,4.9 101.4,5 101.3,9.2 111.2,19 115.7,19.1 119.9,23.3
  pour Top (isolate 1.5, no thermals): 119.8,48.9 113.9,54.3 113.8,57.6 115.5,59.5 125,59.5 131,53.51 130.9,20.3 120.7,10 108.4,10 106.4,8 106.4,4.9 101.3,5 101.2,9.2 111.1,19 115.6,19.1 119.8,23.3
N$26  (via drill 3.5)
  other vias: 3,70.5
N$27  (via drill 3.5)  (1 unrouted)
  other vias: 3,24.5 74.5,3
N$28
  Bottom 0.5: D4.C 57.8,25.9 58.4,25.9 59.5,24.8 C16.1 61,24.8 62.1,23.7 62.1,21.2 62.7,20.6 65.6,20.6 66,21 66,22.87 U6.VC
N$29
  Bottom 0.5: R6.1 50.9,14.97 U3.LEDA
N$30
  Bottom 0.5: D5.C 80.3,26.1 81.6,24.8 C18.1 83.2,24.8 84.2,23.8 84.2,21.2 84.9,20.5 87.7,20.5 88.1,20.9 88.1,22.97 U8.VC
N$31
  Bottom 0.5: R7.1 41.6,14.97 U4.LEDC
N$33  (via drill 3.5)  (1 unrouted)
  other vias: 127,70.5 127,13.5
N$34
  Bottom 0.5: R8.1 44.2,14.97 U4.LEDA
N$35
  Bottom 0.5: R9.1 69.7,14.97 U5.LEDC
N$36
  Bottom 0.5: R11.1 72.3,14.97 U5.LEDA
N$37
  Bottom 0.5: R13.1 63.3,14.97 U6.LEDC
N$38
  Bottom 0.5: R14.1 65.9,14.97 U6.LEDA
N$39
  Bottom 0.5: R15.1 91.9,14.97 U7.LEDC
N$40
  Bottom 0.5: R16.1 94.5,14.97 U7.LEDA
N$41
  Bottom 0.5: R17.1 85.5,14.97 U8.LEDC
N$42
  Bottom 0.5: R18.1 88.1,14.97 U8.LEDA
N$43
  Bottom 0.5: U8.VO 86.8,25.3 | 86.8,25.3 86.5,25.6 R20.P$2 | D11.C 88.9,25.3 86.8,25.3
N$44
  Bottom 0.5: U5.VO 71,25.3 | 71,25.3 70.7,25.6 R22.P$2 | D8.C 73.1,25.3 71,25.3
N$46
  Bottom 0.5: U7.VO 93.2,25.3 | 93.2,25.3 92.9,25.6 R21.P$2 | D10.C 95.3,25.3 93.2,25.3
N$47
  Bottom 0.5: U4.VO 42.9,25.3 | 42.9,25.3 42.7,25.5 R24.P$2 | D7.C 45,25.3 42.9,25.3
N$48
  Bottom 0.5: Q3.1 39.6,46.72 39.6,32.1 43.7,28 43.7,27.7 | R24.P$1 43.7,27.7 | D7.A 43.7,27.7
V1KDC
  Top 3: Q5.2 70.7,56.5 67.4,56.5 67.4,69.95 | Q7.2 99.3,56.5 96.1,56.5 96.1,69.95 | Q3.2 47.3,56.5 50,59.2 50,69.5 49.8,69.7
  Top 4: C4.1A 97.1,69.95 96.1,69.95 C4.1B 67.6,69.95 67.4,69.95 C2.1A C2.1B 37.9,69
  Signal 3: Q5.2 71.6,56.5 | Q7.2 101,56.5 | 44.2,56.5 50.6,56.5
  Bottom 1: R1.P$2 36.4,68.5 C2.1B
  Bottom 2: C3.P$1 79.2,69.1 C4.1B | C26.P$1 38.7,69.1 C2.1B
  pour Top (no thermals): 43,66.9 99,67 101,69 101,71 100,72 37.5,72 arc90 35.5,70 35.5,68.97 arc89 37.47,66.97
  pour Top (no thermals): 49,64.6 49,61 44.3,56.6 47.1,53.9 71.5,53.9 73,55.4 73,57.4 70,60.2 70,63.7 73.4,66.9 98.1,66.9 99.4,68.9 98,70.3 56.5,70.4 45.8,70.4 45.8,67.6
  pour Top (no thermals): 102,57 98.9,60.1 98.9,64.6 101,66.7 101,71 100.5,71.5 80.5,71.5 88.7,63.5 88.7,59.6 94.9,53.4 100,53.5 102,55.5
  pour Signal (no thermals): 56.5,67.4 60.3,63.5 60.3,58.8 65.3,53.9 71.5,53.9 73,55.4 73,57.4 70,60.2 70,63.7 73.4,66.9 98.1,66.9 99.4,68.9 98,70.3 56.5,70.4
  pour Signal (no thermals): 102,57 98.9,60.1 98.9,64.6 101,66.7 101,71 100.5,71.5 80.5,71.5 88.7,63.5 88.7,59.6 94.9,53.4 100,53.5 102,55.5
  pour Signal (no thermals): 48.9,64.6 48.9,61 44.2,56.6 47,53.9 71.4,53.9 72.9,55.4 72.9,57.4 69.9,60.2 69.9,63.7 73.3,66.9 98,66.9 99.3,68.9 97.9,70.3 56.4,70.4 45.7,70.4 45.7,67.6
  pour Signal (no thermals): 43,66.9 99,67 101,69 101,71 100,72 37.5,72 arc90 35.5,70 35.5,68.97 arc89 37.47,66.97
VCC  (via drill 0.35)
  Top 0.35: U10.1 79.4,12.5 C20.1 80,13 80,13.8 80.9,14.7 v81.7,14.7
  Top 0.5: C30.1 v42.2,2.5 | C29.1 57.4,2.7 v57.2,2.7
  Top 0.75: v27.8,14.6 27.7,14.6
  Signal 0.75: v3.5,45.9 3.5,38.1 27,14.6 v27.8,14.6
  Bottom 0.35: U1.21 22.29,14.61 | 22.29,14.61 22.3,14.61 21.66,15.25 U1.20 | U2.21 106.4,17.59 | U2.20 107.03,16.95 106.4,17.59 | 22.29,14.61 22.3,14.6 23.3,14.6 | 23.3,14.6 v27.8,14.6 | C9.1 23.3,14.6 | 106.4,17.59 106.39,17.6 104.9,17.6 | 104.9,17.6 v102,17.6 | C12.1 104.9,18.6 104.9,17.6 | C19.1 13.55,55.7 U9.1 | 11.05,55.45 11,55.4 | 9.1,55.6 9.3,55.4
  Bottom 0.5: J1.6 37.27,7.43 C24.1 C23.1 | CN4.1 80.1,13.1 v81.7,14.7
  Bottom 0.75: C19.1 11,55.4 9.3,55.4 8.3,55.4 8.2,55.3 3.5,50.6 v3.5,45.9 C25.1
  pour Signal (isolate 0.35, rank 3): 21.5,23.1 21.5,10 32.5,-1 85.1,-1 104.9,19.5 104.9,28.5 26.8,28.4
  pour Signal (isolate 0.5, no thermals): 0.7,47.5 6.3,47.5 12.8,41 18.6,41 32.6,27 32.8,5.6 0.7,37.7
VCCM  (1 unrouted)
  Top 0.75: 33.2,4.77 J1.2 | 33.3,4.8 34.8,4.8
  Bottom 0.5: U3.VC 50.87,21.53 51.2,21.2 C13.1 54.2,21.2 55.95,19.45 | U5.VC 72.27,21.53 72.5,21.3 75.1,21.3 C15.1 79.2,21.2 D5.A | U7.VC 95.8,23 96.4,23.6 C17.1 98.4,23.6 99.1,22.9 99.1,21.2 95.3,17.4 | C21.1 C22.1
  Bottom 0.75: J1.2 J1.4 34.73,9.43 | 34.73,9.43 38.4,13.1 | 38.4,13.1 40.3,15 40.3,16.7 41,17.4 53.9,17.4 55.95,19.45 56.8,20.3 57,20.3 | D4.A 56.9,21 56.9,20.4 57,20.3 | D5.A 79,21.1 79.2,20.9 | D5.A 79.7,21.3 | 95.3,17.4 83.6,17.4 82.1,17.4 | 57,20.3 58.9,20.3 61.8,17.4 74.8,17.4 74.9,17.4 77.7,14.6 79.3,14.6 82.1,17.4 | D3.A 35.3,16.2 38.4,13.1 | 82.1,17.4 82.1,18.5 D5.A | C22.1 33.66,10.5 34.73,9.43

### Text on the board
Bottom: JAW 2014-09
tPlace: JAW 2014-09 | www.791rl.com | GPI1PWR Rev. 1 | DC IN | AC OUT | 240V | 450V MAX | H2 | H1 | --- | + | -
bPlace: DANGER | Genius hath electric power / Which earth can never tame, / Bright suns may scorch and / dark clouds lower, / Its flash is still the same. / -- Lydia Maria Child | HIGH VOLTAGE | DANGER | Pb | VERY UNSAFE! | HIGH VOLTAGE | G | T | V | DC IN | AC OUT
bStop: JAW 2014-09